# Altium project NewSpeedRadar_Board.PrjPcb
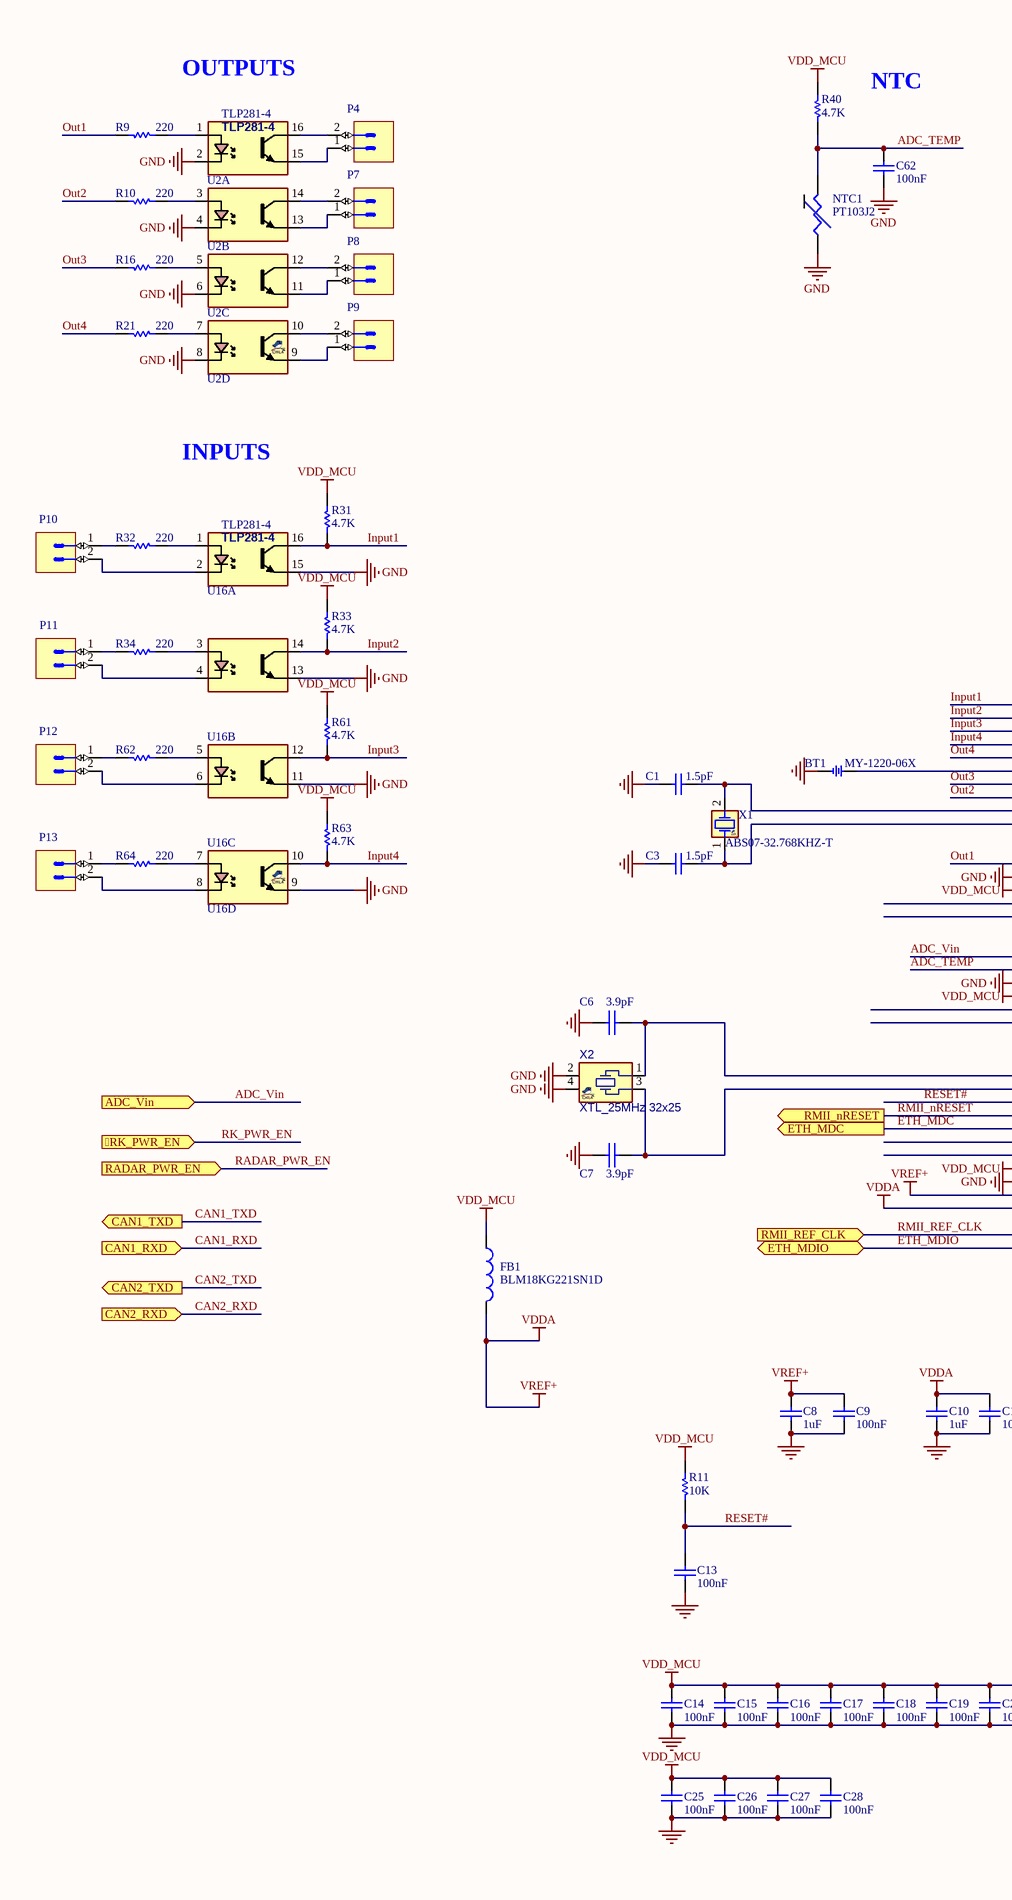
[diagram p0: STM32H743IIT6.SchDoc, left]
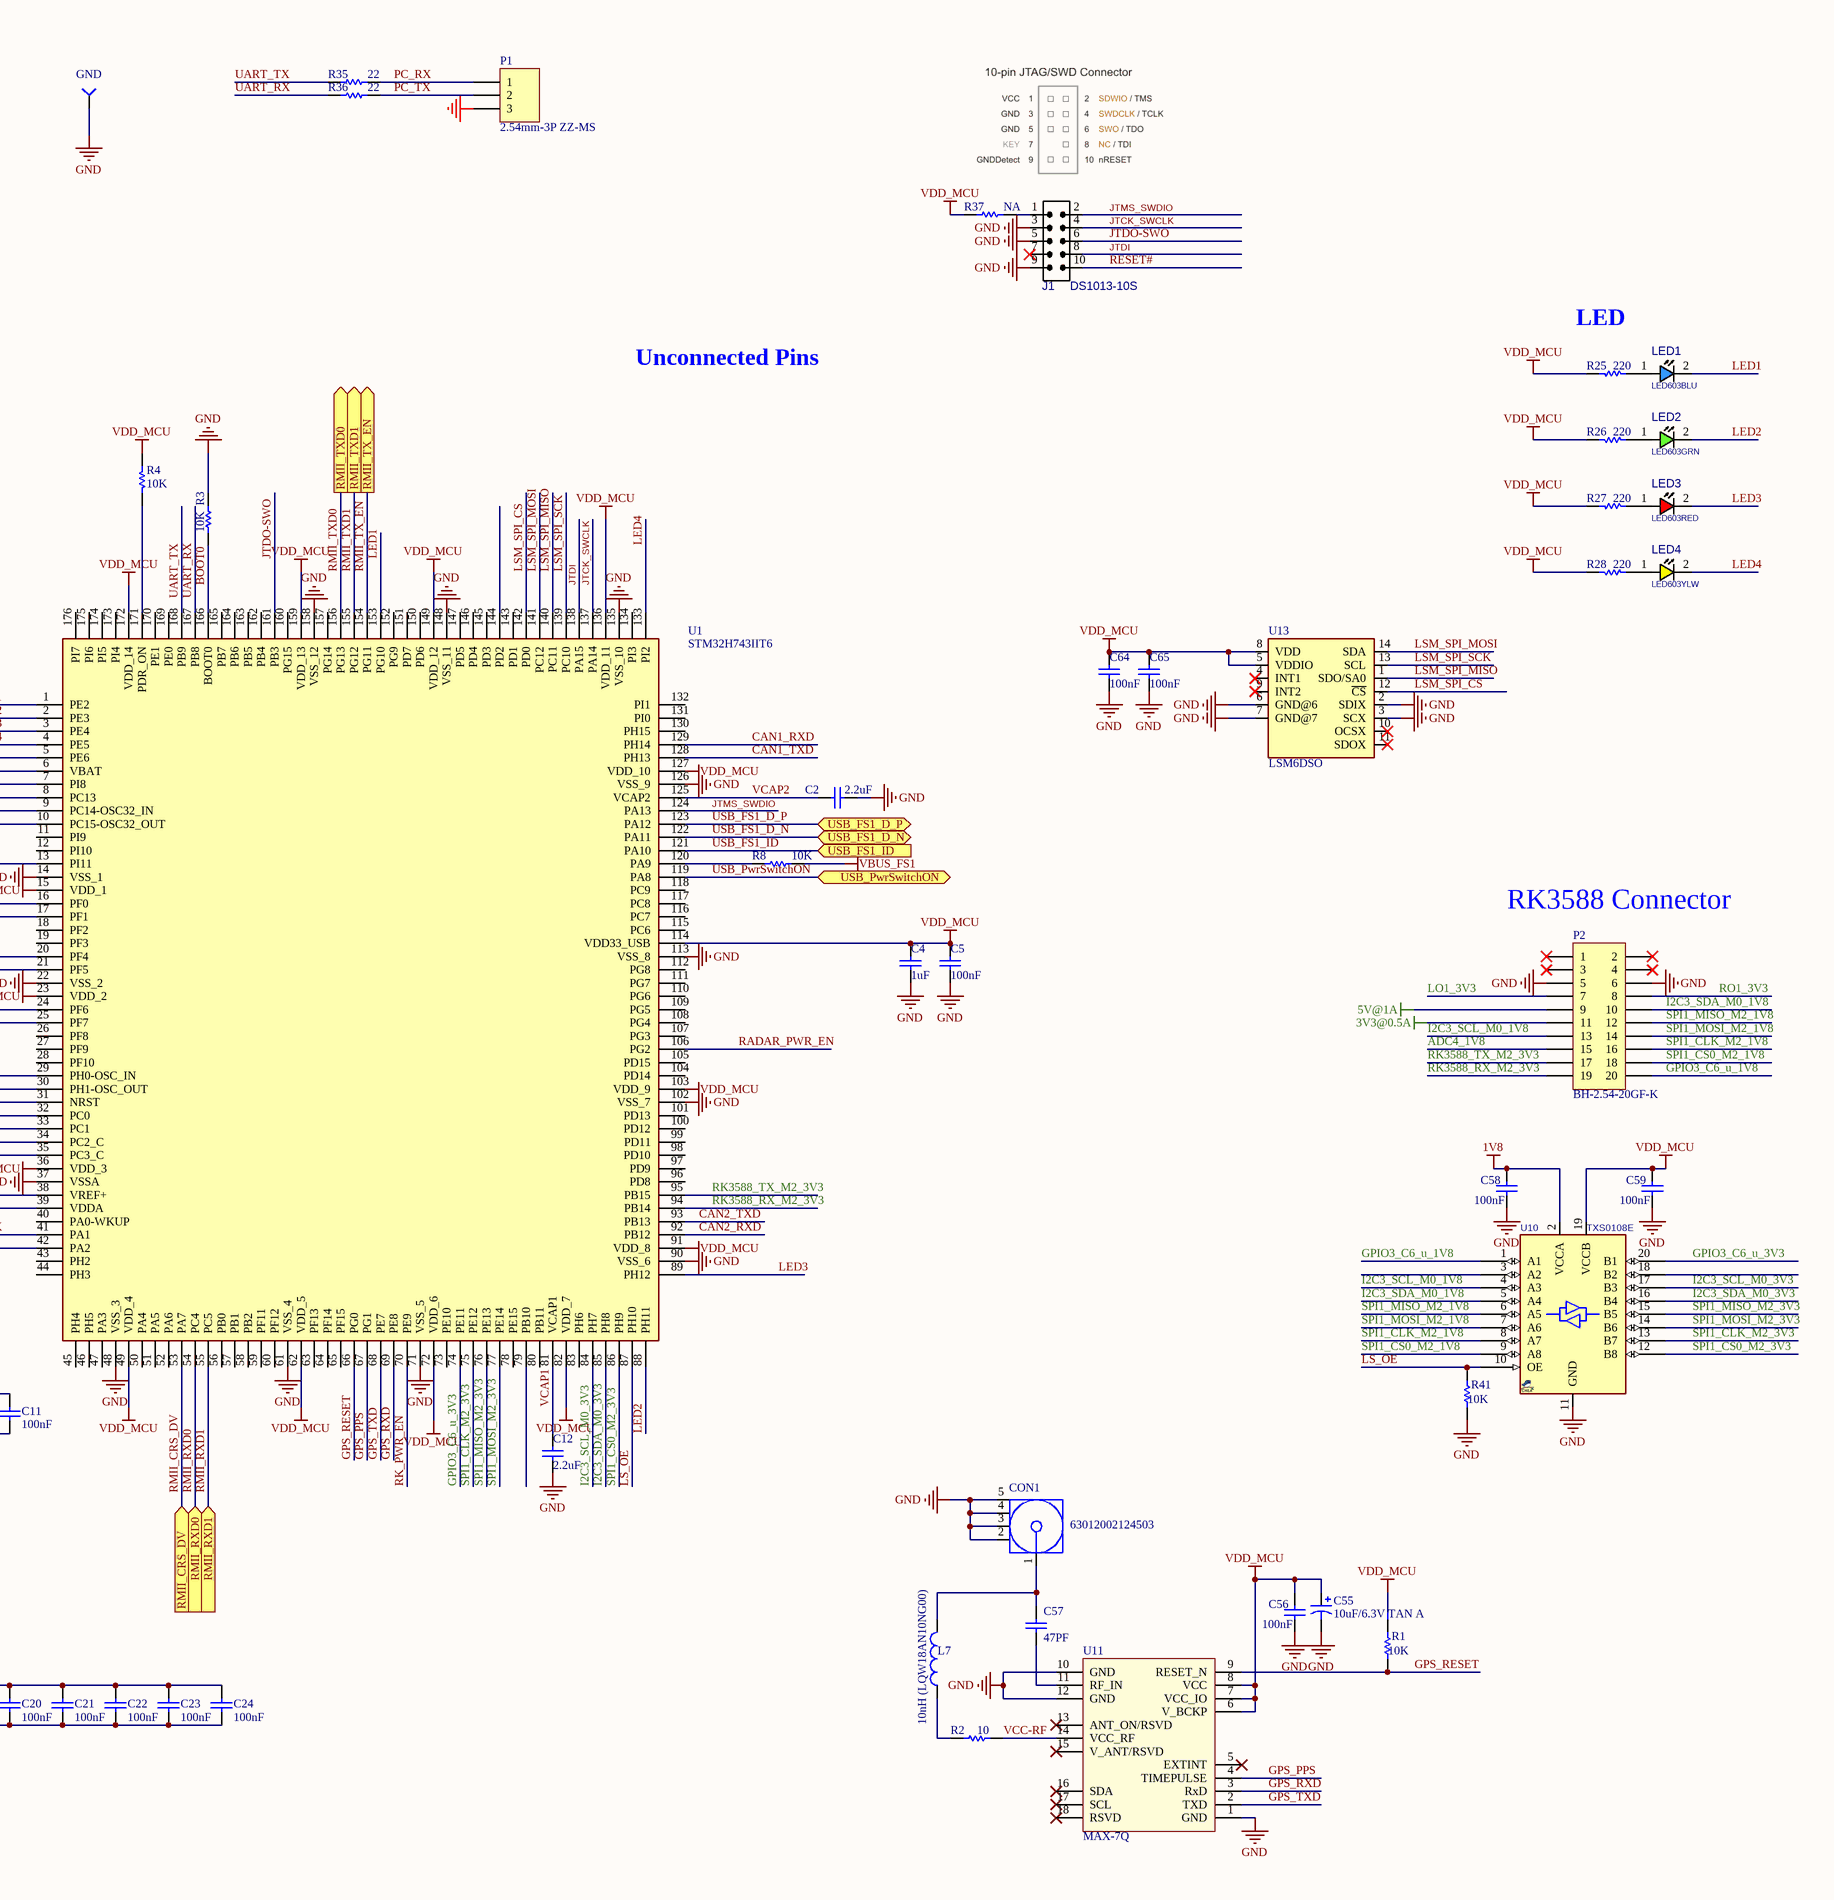
[diagram p1: STM32H743IIT6.SchDoc, right]
4 sheets, 208 parts. Net scope: flat (ports and power ports of the same name join across sheets).
Board file: NewSpeedRadar_Board.PcbDoc
Sheets:
  STM32H743IIT6.SchDoc
  Ethernet.SchDoc
  USB_OTG_FS.SchDoc
  Power_CAN_IO_GPS.SchDoc

## Sheet STM32H743IIT6.SchDoc
size A2

### Parts
BT1  MY-1220-06X  [BAT-TH_MY-1220-01]
C1  1.5pF  [C0603]
C2  2.2uF  [C0603]
C3  1.5pF  [C0603]
C4  1uF  [C0603]
C5  100nF  [C0603]
C6  3.9pF  [C0603]
C7  3.9pF  [C0603]
C8  1uF  [C0603]
C9  100nF  [C0603]
C10  1uF  [C0603]
C11  100nF  [C0603]
C12  2.2uF  [C0603]
C13  100nF  [C0603]
C14  100nF  [C0603]
C15  100nF  [C0603]
C16  100nF  [C0603]
C17  100nF  [C0603]
C18  100nF  [C0603]
C19  100nF  [C0603]
C20  100nF  [C0603]
C21  100nF  [C0603]
C22  100nF  [C0603]
C23  100nF  [C0603]
C24  100nF  [C0603]
C25  100nF  [C0603]
C26  100nF  [C0603]
C27  100nF  [C0603]
C28  100nF  [C0603]
C55  10uF/6.3V TAN A  [TANTALUM-A]
C56  100nF  [C0603]
C57  47PF  [C0603]
C58  100nF  [C0603]
C59  100nF  [C0603]
C62  100nF  [C0603]
C64  100nF  [C0603]
C65  100nF  [C0603]
CON1  63012002124503  [SMA]
FB1  BLM18KG221SN1D  [L0603E]
GND  TEST POINT  [TEST_POINT]  (value not drawn)  (no BOM)
J1  DS1013-10S  [IDC_2X5]
L7  10nH (LQW18AN10NG00)  [L0603E]
LED1  LED603BLU  [LED0603BLU]
LED2  LED603GRN  [LED0603GRN]
LED3  LED603RED  [LED0603RED]
LED4  LED603YLW  [LED0603YLW]
NTC1  PT103J2  [HDR1X2]
P1  2.54mm-3P ZZ-MS  [xh-3]
P2  BH-2.54-20GF-K  [HDR2X10]
P4  JST PH 2mm 2P RIGHT  [JST B2B-PH-K]  (value not drawn)
P7  JST PH 2mm 2P RIGHT  [JST B2B-PH-K]  (value not drawn)
P8  JST PH 2mm 2P RIGHT  [JST B2B-PH-K]  (value not drawn)
P9  JST PH 2mm 2P RIGHT  [JST B2B-PH-K]  (value not drawn)
P10  JST PH 2mm 2P RIGHT  [JST B2B-PH-K]  (value not drawn)
P11  JST PH 2mm 2P RIGHT  [JST B2B-PH-K]  (value not drawn)
P12  JST PH 2mm 2P RIGHT  [JST B2B-PH-K]  (value not drawn)
P13  JST PH 2mm 2P RIGHT  [JST B2B-PH-K]  (value not drawn)
R1  10K  [R0603]
R2  10  [R0603]
R3  10K  [R0603]
R4  10K  [R0603]
R8  10K  [R0603]
R9  220  [R0603]
R10  220  [R0603]
R11  10K  [R0603]
R16  220  [R0603]
R21  220  [R0603]
R25  220  [R0603]
R26  220  [R0603]
R27  220  [R0603]
R28  220  [R0603]
R31  4.7K  [R0603]
R32  220  [R0603]
R33  4.7K  [R0603]
R34  220  [R0603]
R35  22  [R0603]
R36  22  [R0603]
R37  NA  [R0603]  (no BOM)
R40  4.7K  [R0603]
R41  10K  [R0603]
R61  4.7K  [R0603]
R62  220  [R0603]
R63  4.7K  [R0603]
R64  220  [R0603]
U1  STM32H743IIT6  [QFP50P2600X2600X160-176N]
U2  TLP281-4  [SO_16]  (parts A,B,C,D of 4)
U10  TXS0108E  [SOG65_20]
U11  MAX-7Q  [MAX]
U13  LSM6DSO  [LGA-14_L3.0-W2.5-P0.50-TL]
U16  TLP281-4  [SO_16]  (parts A,B,C,D of 4)
X1  ABS07-32.768KHZ-T  [XTL_2_3215]
X2  XTL_25MHz 32x25  [XTL_4_3225]

### Ports
RK_PWR_EN (in), ADC_Vin (in), CAN1_RXD (in), CAN1_TXD (out), CAN2_RXD (in), CAN2_TXD (out), ETH_MDC (out), ETH_MDIO (bidir), RADAR_PWR_EN (in), RMII_CRS_DV (in), RMII_nRESET (out), RMII_REF_CLK (in), RMII_RXD0 (in), RMII_RXD1 (in), RMII_TX_EN (out), RMII_TXD0 (out), RMII_TXD1 (out), USB_FS1_D_N (bidir), USB_FS1_D_P (bidir), USB_FS1_ID (in), USB_PwrSwitchON (bidir)

### Nets
1V8: C58.1 U10.2(VCCA)
3V3@0.5A: P2.11
5V@1A: P2.9
GND: BT1.2 C1.2 C2.2 C3.2 C4.1 C5.1 C6.2 C7.2 C8.1 C9.1 C10.1 C11.1 C12.1 C13.1 C14.2 C15.2 C16.2 C17.2 C18.2 C19.2 C20.2 C21.2 C22.2 C23.2 C24.2 C25.2 C26.2 C27.2 C28.2 C55.2 C56.2 C58.2 C59.2 C62.1 C64.1 C65.1 CON1.2(GND) CON1.3(GND) CON1.4(GND) CON1.5(GND) GND.1(TP) J1.3 J1.5 J1.9 NTC1.1 P1.3 P2.5 P2.6 R3.2 R41.1 U1.14(VSS_1) U1.22(VSS_2) U1.37(VSSA) U1.48(VSS_3) U1.61(VSS_4) U1.71(VSS_5) U1.90(VSS_6) U1.102(VSS_7) U1.113(VSS_8) U1.126(VSS_9) U1.135(VSS_10) U1.148(VSS_11) U1.158(VSS_12) U2.2 U2.4 U2.6 U2.8 U10.11(GND) U11.1(GND) U11.10(GND) U11.12(GND) U13.2(SDIX) U13.3(SCX) U13.6(GND@6) U13.7(GND@7) U16.9 U16.11 U16.13 U16.15 X2.2 X2.4
VBUS_FS1: R8.1
VDD_MCU: C4.2 C5.2 C14.1 C15.1 C16.1 C17.1 C18.1 C19.1 C20.1 C21.1 C22.1 C23.1 C24.1 C25.1 C26.1 C27.1 C28.1 C55.1 C56.1 C59.1 C64.2 C65.2 FB1.1 R1.2 R4.1 R11.1 R25.1 R26.1 R27.1 R28.1 R31.2 R33.2 R37.2 R40.1 R61.2 R63.2 U1.15(VDD_1) U1.23(VDD_2) U1.36(VDD_3) U1.49(VDD_4) U1.62(VDD_5) U1.72(VDD_6) U1.82(VDD_7) U1.91(VDD_8) U1.103(VDD_9) U1.114(VDD33_USB) U1.127(VDD_10) U1.136(VDD_11) U1.149(VDD_12) U1.159(VDD_13) U1.172(VDD_14) U10.19(VCCB) U11.6(V_BCKP) U11.7(VCC_IO) U11.8(VCC) U13.5(VDDIO) U13.8(VDD)
VDDA: C8.2 C9.2 C10.2 C11.2 FB1.2 U1.38(VREF+) U1.39(VDDA)  [also labelled VREF+]
ADC4_1V8: P2.15
ADC_TEMP: C62.2 NTC1.2 R40.2 U1.21(PF5)
ADC_Vin: U1.20(PF4) ; port ADC_Vin
BOOT0: R3.1 U1.166(BOOT0)
CAN1_RXD: U1.129(PH14) ; port CAN1_RXD
CAN1_TXD: U1.128(PH13) ; port CAN1_TXD
CAN2_RXD: U1.92(PB12) ; port CAN2_RXD
CAN2_TXD: U1.93(PB13) ; port CAN2_TXD
ETH_MDC: U1.33(PC1) ; port ETH_MDC
ETH_MDIO: U1.42(PA2) ; port ETH_MDIO
GPIO3_C6_u_1V8: P2.20 U10.1(A1)
GPIO3_C6_u_3V3: U1.74(PE11) U10.20(B1)
GPS_PPS: U1.67(PG1) U11.4(TIMEPULSE)
GPS_RESET: R1.1 U1.66(PG0) U11.9(RESET_N)
GPS_RXD: U1.69(PE8) U11.3(RxD)
GPS_TXD: U1.68(PE7) U11.2(TXD)
I2C3_SCL_M0_1V8: P2.13 U10.4(A3)
I2C3_SCL_M0_3V3: U1.84(PH7) U10.17(B3)
I2C3_SDA_M0_1V8: P2.10 U10.5(A4)
I2C3_SDA_M0_3V3: U1.85(PH8) U10.16(B4)
Input1: R31.1 U1.1(PE2) U16.16
Input2: R33.1 U1.2(PE3) U16.14
Input3: R61.1 U1.3(PE4) U16.12
Input4: R63.1 U1.4(PE5) U16.10
JTCK_SWCLK: J1.4 U1.137(PA14)
JTDI: J1.8 U1.138(PA15)
JTDO-SWO: J1.6 U1.161(PB3)
JTMS_SWDIO: J1.2 U1.124(PA13)
LED1: LED1.2(CATHODE) U1.153(PG10)
LED2: LED2.2(CATHODE) U1.88(PH11)
LED3: LED3.2(CATHODE) U1.89(PH12)
LED4: LED4.2(CATHODE) U1.133(PI2)
LO1_3V3: P2.7
LS_OE: R41.2 U1.87(PH10) U10.10(OE)
LSM_SPI_CS: U1.142(PD0) U13.12(~{CS})
LSM_SPI_MISO: U1.140(PC11) U13.1(SDO/SA0)
LSM_SPI_MOSI: U1.141(PC12) U13.14(SDA)
LSM_SPI_SCK: U1.139(PC10) U13.13(SCL)
Out1: R9.1 U1.13(PI11)
Out2: R10.1 U1.8(PC13)
Out3: R16.1 U1.7(PI8)
Out4: R21.1 U1.5(PE6)
PC_RX: P1.1 R35.1
PC_TX: P1.2 R36.1
RADAR_PWR_EN: U1.106(PG2) ; port RADAR_PWR_EN
RESET#: C13.2 J1.10 R11.2 U1.31(NRST)
RK3588_RX_M2_3V3: P2.19 U1.94(PB14)
RK3588_TX_M2_3V3: P2.17 U1.95(PB15)
RK_PWR_EN: U1.70(PE9) ; port RK_PWR_EN
RMII_CRS_DV: U1.53(PA7) ; port RMII_CRS_DV
RMII_nRESET: U1.32(PC0) ; port RMII_nRESET
RMII_REF_CLK: U1.41(PA1) ; port RMII_REF_CLK
RMII_RXD0: U1.54(PC4) ; port RMII_RXD0
RMII_RXD1: U1.55(PC5) ; port RMII_RXD1
RMII_TX_EN: U1.154(PG11) ; port RMII_TX_EN
RMII_TXD0: U1.156(PG13) ; port RMII_TXD0
RMII_TXD1: U1.155(PG12) ; port RMII_TXD1
RO1_3V3: P2.8
SPI1_CLK_M2_1V8: P2.16 U10.8(A7)
SPI1_CLK_M2_3V3: U1.75(PE12) U10.13(B7)
SPI1_CS0_M2_1V8: P2.18 U10.9(A8)
SPI1_CS0_M2_3V3: U1.86(PH9) U10.12(B8)
SPI1_MISO_M2_1V8: P2.12 U10.6(A5)
SPI1_MISO_M2_3V3: U1.76(PE13) U10.15(B5)
SPI1_MOSI_M2_1V8: P2.14 U10.7(A6)
SPI1_MOSI_M2_3V3: U1.77(PE14) U10.14(B6)
UART_RX: R36.2 U1.167(PB8)
UART_TX: R35.2 U1.168(PB9)
USB_FS1_D_N: U1.122(PA11) ; port USB_FS1_D_N
USB_FS1_D_P: U1.123(PA12) ; port USB_FS1_D_P
USB_FS1_ID: U1.121(PA10) ; port USB_FS1_ID
USB_PwrSwitchON: U1.119(PA8) ; port USB_PwrSwitchON
VCAP1: C12.2 U1.81(VCAP1)
VCAP2: C2.1 U1.125(VCAP2)
VCC-RF: R2.1 U11.14(VCC_RF)
NetBT1_1: BT1.1 U1.6(VBAT)
NetC1_1: C1.1 U1.9(PC14-OSC32_IN) X1.2(OSC2)
NetC3_1: C3.1 U1.10(PC15-OSC32_OUT) X1.1(OSC1)
NetC6_1: C6.1 U1.29(PH0-OSC_IN) X2.1
NetC7_1: C7.1 U1.30(PH1-OSC_OUT) X2.3
NetC57_1: C57.1 CON1.1(Signal) L7.2
NetC57_2: C57.2 U11.11(RF_IN)
NetJ1_1: J1.1 R37.1
NetL7_1: L7.1 R2.2
NetLED1_1: LED1.1(ANODE) R25.2
NetLED2_1: LED2.1(ANODE) R26.2
NetLED3_1: LED3.1(ANODE) R27.2
NetLED4_1: LED4.1(ANODE) R28.2
NetP4_1: P4.1 U2.15
NetP4_2: P4.2 U2.16
NetP7_1: P7.1 U2.13
NetP7_2: P7.2 U2.14
NetP8_1: P8.1 U2.11
NetP8_2: P8.2 U2.12
NetP9_1: P9.1 U2.9
NetP9_2: P9.2 U2.10
NetP10_1: P10.1 R32.1
NetP10_2: P10.2 U16.2
NetP11_1: P11.1 R34.1
NetP11_2: P11.2 U16.4
NetP12_1: P12.1 R62.1
NetP12_2: P12.2 U16.6
NetP13_1: P13.1 R64.1
NetP13_2: P13.2 U16.8
NetR4_2: R4.2 U1.171(PDR_ON)
NetR8_2: R8.2 U1.120(PA9)
NetR9_2: R9.2 U2.1
NetR10_2: R10.2 U2.3
NetR16_2: R16.2 U2.5
NetR21_2: R21.2 U2.7
NetR32_2: R32.2 U16.1
NetR34_2: R34.2 U16.3
NetR62_2: R62.2 U16.5
NetR64_2: R64.2 U16.7

Not connected (* = marked no-connect by the designer): J1 7*; P2 1* 2* 3* 4*; U1 11(PI9) 12(PI10) 16(PF0) 17(PF1) 18(PF2) 19(PF3) 24(PF6) 25(PF7) 26(PF8) 27(PF9) 28(PF10) 34(PC2_C) 35(PC3_C) 40(PA0-WKUP) 43(PH2) 44(PH3) 45(PH4) 46(PH5) 47(PA3) 50(PA4) 51(PA5) 52(PA6) 56(PB0) 57(PB1) 58(PB2) 59(PF11) 60(PF12) 63(PF13) 64(PF14) 65(PF15) 73(PE10) 78(PE15) 79(PB10) 80(PB11) 83(PH6) 96(PD8) 97(PD9) 98(PD10) 99(PD11) 100(PD12) 101(PD13) 104(PD14) 105(PD15) 107(PG3) 108(PG4) 109(PG5) 110(PG6) 111(PG7) 112(PG8) 115(PC6) 116(PC7) 117(PC8) 118(PC9) 130(PH15) 131(PI0) 132(PI1) 134(PI3) 143(PD1) 144(PD2) 145(PD3) 146(PD4) 147(PD5) 150(PD6) 151(PD7) 152(PG9) 157(PG14) 160(PG15) 162(PB4) 163(PB5) 164(PB6) 165(PB7) 169(PE0) 170(PE1) 173(PI4) 174(PI5) 175(PI6) 176(PI7); U10 3(A2) 18(B2); U11 5(EXTINT)* 13(ANT_ON/RSVD)* 15(V_ANT/RSVD)* 16(SDA)* 17(SCL)* 18(RSVD)*; U13 4(INT1)* 9(INT2)* 10(OCSX)* 11(SDOX)*

### Notes on the sheet
- OUTPUTS
- NTC
- Unconnected Pins
- LED
- INPUTS
- (near P2) RK3588 Connector

### Library data of the parts
BT1 = BATH_CR1220: BATTERY HOLDER, CR1220; VALUE: BAT3volt; MANF_P#: -; .: http://www.chila.ir
C1 C3 = Capacitor_ST: Value: 100nF; Revision: July-2002: Re-released for DXP Platform.
C2 C4 C5 C8-C12 C64 C65 = Cap: Value: 10nF; Published: 8-Jun-2000; Revision: July-2002: Re-released for DXP Platform.; Publisher: Altium Limited
C6 C7 C14-C28 = CAP
  C14-C28: Published: 8-Jun-2000; Revision: July-2002: Re-released for DXP Platform.; Publisher: Altium Limited; Value: 100nF
C13 C62 = CAP: Value: 100pF; Published: 8-Jun-2000; Revision: July-2002: Re-released for DXP Platform.; Publisher: Altium Limited
C55 = CAP POL1: SMD Capacitor Tantalum 1UF 10V 10% 1206; Manufacturer: Vishay or Panasonic; Foot print: 1206 (3216 Metric); Published: 8-Jun-2000; LatestRevisionDate: 17-Jul-2002; LatestRevisionNote: Re-released for DXP Platform.; PackageReference: RB7.6-15; Publisher: Altium Limited; Value: 10uF/6.3V TAN A
C56 C58 C59 = Cap: Ceramic Capacitor; Manufacturer: Vishay or Panasonic; Foot print: 0805 (2012 Metric); Published: 8-Jun-2000; LatestRevisionDate: 17-Jul-2002; LatestRevisionNote: Re-released for DXP Platform.; PackageReference: RAD-0.3; Publisher: Altium Limited; Value: 100nF
C57 = Cap: Chip Monolithic Ceramic Capacitor; SMD; Manufacturer: Murata Electronics North America; Manufacturer Part Number: GRM188R71C104KA01D; Current Footprint: 0603 (1608 Metric); Board Qty: 100; PCB Name: Main_PCB; Packing List: CL10B104KB8NNNC; ITEM/NO: 40; ComponentLink1Description: Datasheet; HelpURL: D:\HNA\Datasheet Documents\c02e.pdf; ComponentLink1URL: D:\HNA\Datasheet Documents\c02e.pdf; Mounting Type: Surface Mount; Supplier: NULL; Part Number: 47PF; Supplier Part Number: NULL; Pricing: NULL; Package / Case: 0603 (1608 Metric); Size / Dimension: NULL; Description1: Chip Monolithic Ceramic Capacitor; SMD
CON1 = 19-46-2-TGG: SMA Connector, PCB THT Jack, Straight; Manufacturer: Amphenol Connex; PartNumber: 132134; Foot print: Through Hole; Published: 12-Dec-2006; DatasheetVersion: rev.A-0, Jul-2002; PackageVersion: rev.A-0, Jul-2002; PackageReference: 19-46-2; Publisher: Altium Limited; PackageDescription: SMA Straight PCB Surface Mount Jack Receptacle; ComponentLink1Description: Manufacturer Link; ComponentLink1URL: http://www.chinnan.com.tw/
FB1 = Inductor: Ferrite Bead; Value: 100uH; Published: 8-Jun-2000; Revision: July-2002: Re-released for DXP Platform.; Publisher: Altium Limited
GND = TEST POINT: Board Qty: 100; PCB Name: Main_PCB
J1 = IDC_2X5: BOX HEADER 2*5 STRAIGHT; VALUE: IDC_2X5
L7 = Inductor: FIXED IND 10NH 300MA 0.10 OHM; Manufacturer: Murata Electronics North America; Manufacturer Part Number: 10nH/1%; Current Footprint: 0603 (1608 Metric); Board Qty: 100; PCB Name: Main_PCB; ITEM/NO: 16; Package / Case: 0603 (1608 Metric); Part Number: 10nH (LQW18AN10NG00); Pricing: 1=0.18, 10=0.167, 25=0.1504, 50=0.1302, 100=0.1169, 250=0.10856, 500=0.1002, 750=0.09519, 1000=0.08684 (USD); Size / Dimension: null; Supplier: null; Supplier Part Number: null
LED1 = LED_SMD_0603_BLU: LED, SMD, 0603, BLUE; PARAM: 30mA, 470nm, 120° Angle; DESC: DESCRIPTION; MANF_P#: MANF_PART#; PARAM2: 2.2~3V; MANF: MANF; ASSEMBLY: ASSEMBLY; PRICE: PRICE; VALUE: LED603BLU
LED2 = LED_SMD_0603_GRN: LED, SMD, 0603, GREEN; PARAM: 20mA; MANF: Kingbright; DESC: DESCRIPTION; MANF_P#: APT1608SGC; PARAM2: 2.2V; ASSEMBLY: ASSEMBLY; PRICE: 1: 0.14$, 100: 6.8$; VALUE: LED603GRN
LED3 = LED_SMD_0603_RED: LED, SMD, 0603, RED; PARAM: 30mA, 640nm; DESC: DESCRIPTION; MANF_P#: MANF_PART#; PARAM2: 1.8~2.5V; MANF: MANF; ASSEMBLY: ASSEMBLY; PRICE: PRICE; VALUE: LED603RED
LED4 = LED_SMD_0603_YLW: LED, SMD, 0603, YELLOW; DESC: DESCRIPTION; MANF_P#: MANF_PART#; PARAM2: 2.2V; MANF: MANF; ASSEMBLY: ASSEMBLY; PRICE: PRICE; VALUE: LED603YLW
NTC1 = NTC power: THERMISTOR 10K OHM +/-0.20 C; Device Code: 143161
P1 = Header 3: 1x3P XH 2.54mm Male Straight Wire To Board Connector; LatestRevisionDate: 17-Jul-2002; LatestRevisionNote: Re-released for DXP Platform.; Publisher: Altium Limited
P2 = Header 10X2: BOX HEADER 2*10 STRAIGHT; LatestRevisionDate: 17-Jul-2002; LatestRevisionNote: Re-released for DXP Platform.; Publisher: Altium Limited
P4 P7-P13 = PHOENIX_1803426: JST PH 2P RIGHT; Part Description: 8A 160 V, Pitch: 3.81mm, 2 Positions Header; Manufacturer: PHOENIX CONTACT; Manufacturer Part Number: 1803426 (MCV 1,5/2-G-3,81); PressFit: No; Part Number: PHOENIX_1803426; Component Kind: Standard; Component Type: Standard; Footprint: PHOENIX_1803426; Pin Count: 2; Mounted: Yes; Socket: No; SMD: No; Sense: No; Status: None; ComponentHeight: 9.2mm; HelpURL: \\cern.ch\dfs\Applications\Altium\Datasheets\PHOENIX_1803426.pdf; Author: CERN DEM JLC; CreateDate: 5/4/2010; LatestRevisionDate: 5/4/2010
R1 R41 = Res1: Resistor: thick film; SMD; Manufacturer: Yageo; Manufacturer Part Number: null; Current Footprint: 0603 (1608 Metric); Board Qty: 100; PCB Name: Main_PCB; Packing List: 0603F1002T5E; ITEM/NO: 20; ComponentLink1Description: Datasheet; HelpURL: D:\HNA\Datasheet Documents\PYu-RC_Group_51_RoHS_L_0.pdf; ComponentLink1URL: D:\HNA\Datasheet Documents\PYu-RC_Group_51_RoHS_L_0.pdf; Mounting Type: Surface Mount; Supplier: NULL; Part Number: 10K; Supplier Part Number: NULL; Pricing: NULL; Description1: Resistor: thick film; SMD; Package / Case: 0603 (1608 Metric); Size / Dimension: NULL
R2 = Res1: Resistor: thick film; SMD; Manufacturer: Yageo; Part Number: 10R; Manufacturer Part Number: null; Current Footprint: 0603 (1608 Metric); Board Qty: 100; PCB Name: Main_PCB; Packing List: 0603F1002T5E; ITEM/NO: 131; ComponentLink1Description: Datasheet; HelpURL: D:\HNA\Datasheet Documents\PYu-RC_Group_51_RoHS_L_0.pdf; ComponentLink1URL: D:\HNA\Datasheet Documents\PYu-RC_Group_51_RoHS_L_0.pdf; Mounting Type: Surface Mount; Supplier: null; Supplier Part Number: null; Pricing: 1=0.1, 10=0.029, 50=0.0162, 100=0.0123, 250=0.00912, 500=0.00672, 1000=0.00448, 2500=0.00378 (USD); Description1: Resistor: thick film; SMD; Package / Case: 0603 (1608 Metric); Size / Dimension: null
R3 R35 R36 = res1: Value: 1K; Published: 8-Jun-2000; Revision: July-2002: Re-released for DXP Platform.; Publisher: Altium Limited
R4 R8-R11 R16 R21 R25-R28 R31-R34 R37 R40 R61-R64 = Res1: Value: 1K; Published: 8-Jun-2000; Revision: July-2002: Re-released for DXP Platform.; Publisher: Altium Limited
U1 = STM32H743IIT6: Integrated Circuit; Manufacturer_Name: STMicroelectronics; Datasheet Link: https://componentsearchengine.com/Datasheets/1/STM32H743IIT6.pdf; Height: 1.6mm; Manufacturer_Part_Number: STM32H743IIT6; Mouser Part Number: 511-STM32H743IIT6; Mouser Price/Stock: https://www.mouser.co.uk/ProductDetail/STMicroelectronics/STM32H743IIT6?qs=FNcb6ahWXRzE163cq8Rfjg%3D%3D; Arrow Part Number: STM32H743IIT6; Arrow Price/Stock: https://www.arrow.com/en/products/stm32h743iit6/stmicroelectronics?region=nac
U2 U16 = OPTC_TR16P_TLP281-4_SMD: OPTOCOUPLER, TRANSISTOR, QUAD; MANF_P#: TLP281-4A; PRICE: 4000t@PAYA; VALUE: TLP281-4; PACKAGE: DIP-16SMD
U10 = TXS0108_SSOP20: Level Translator, Octal; MANF: Texas Instruments; MANF_P#: TXS0108EPWR; VALUE: TXS0108E
U11 = MAX: GPS chip module MAX-7Q; Manufacturer-1: ShenZhen Tifull Technology Ltd.; Manufacturer Part Number-1: TF1097U7M3; Part Number: EPP0910; Manufacturer: NULL; Current Footprint: SMD; Board Qty: 100; PCB Name: Main_PCB; ITEM/NO: 117; Package / Case: SMD; Part Number-1: MAX-7Q; Pricing: 1=12.00000, 100=12.00000 (USD); Size / Dimension: NULL; Supplier: Octopart; Supplier Part Number: Seeed Studio - 317050009; HelpURL: D:\HNA\Datasheet Documents\u-blox-MAX-7_DataSheet_(GPS.G7-HW-12012)_2.pdf; Part Number-2: TF1097U7M3; Manufacturer Part Number: NULL
U13 = LSM6DSO: SPARKFUN 6 DEGREES OF FREEDOM BR; MF: STMicroelectronics; SnapEDA_Link: https://www.snapeda.com/parts/LSM6DSO/STMicroelectronics/view-part/?ref=snap; Purchase-URL: https://pricing.snapeda.com/search/part/LSM6DSO/?ref=eda; Price: None; Availability: In Stock; Package: None; Check_prices: https://www.snapeda.com/parts/LSM6DSO/STMicroelectronics/view-part/?ref=eda; Value: *; MP: LSM6DSO
X1 = XTL_2_32.768_3215A: Crystal, 32.768KHz, 3pF, 20PPM; MANF: ABRACON; MANF_P#: ABS07W-32.768kHz-D-2-T; PARAM: -40~85oC; VALUE: XTL_32.768KHz; PARAM2: 3pF, 20PPM; PRICE: 1$
X2 = XTL_4_25MHz_3225: CRYSTAL 25.00 MHZ 18pF, 10PPM; MANF: EPSON; DESC: DESCRIPTION; DIST#: MOUSER; PARAM2: PARAM; MANF_P#: TSX-3225 25.0000MF10P-C3; ASSEMBLY: ASSEMBLY; PARAM: 10PPM; PRICE: 0.5$; VALUE: XTL_25MHz 32x25

## Sheet Ethernet.SchDoc: Ethernet
size A3; DocumentNumber: MB1246; Revision: B.1; SheetNumber: 7; SheetTotal: 17; Project: STM32H7xxI-EVAL
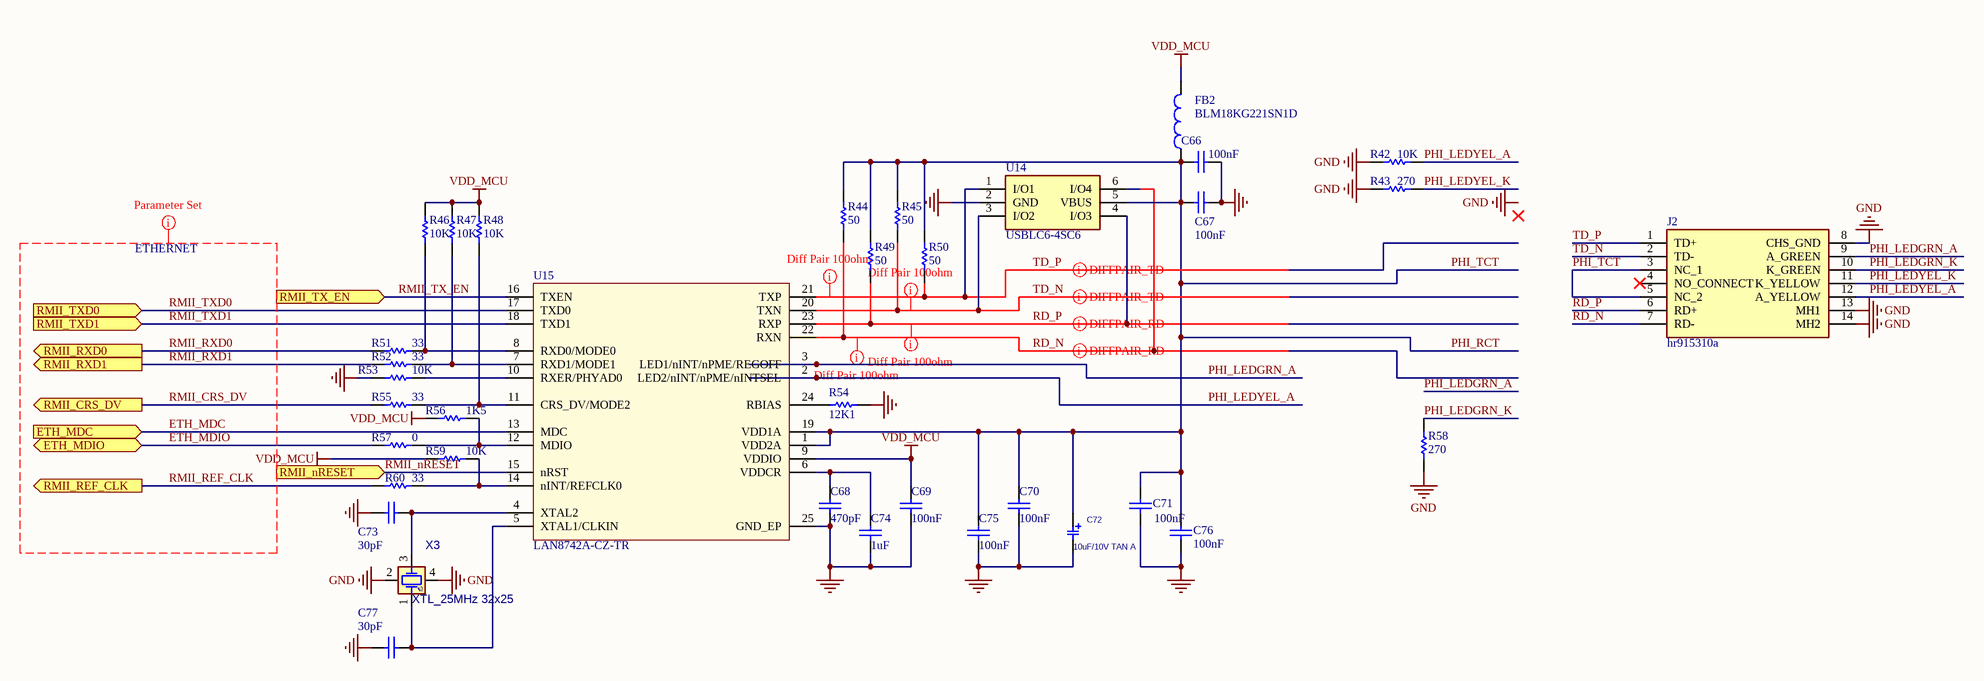
[diagram p2: Ethernet.SchDoc]

### Parts
C66  100nF  [C0603]
C67  100nF  [C0603]
C68  470pF  [C0603]
C69  100nF  [C0603]
C70  100nF  [C0603]
C71  100nF  [C0603]
C72  10uF/10V TAN A  [C_TN_3216]
C73  30pF  [C0603]
C74  1uF  [C0603]
C75  100nF  [C0603]
C76  100nF  [C0603]
C77  30pF  [C0603]
FB2  BLM18KG221SN1D  [L0603E]
J2  hr915310a  [hr915310a]
R42  10K  [R0603]
R43  270  [R0603]
R44  50  [R0603]
R45  50  [R0603]
R46  10K  [R0603]
R47  10K  [R0603]
R48  10K  [R0603]
R49  50  [R0603]
R50  50  [R0603]
R51  33  [R0603]
R52  33  [R0603]
R53  10K  [R0603]
R54  12K1  [R0603]
R55  33  [R0603]
R56  1K5  [R0603]
R57  0  [R0603]
R58  270  [R0603]
R59  10K  [R0603]
R60  33  [R0603]
U14  USBLC6-4SC6  [SOT95P280X145-6N]
U15  LAN8742A-CZ-TR  [QFN50P400X400X100-25N-D]
X3  XTL_25MHz 32x25  [XTL_4_3225]

### Ports
ETH_MDC (in), ETH_MDIO (bidir), RMII_CRS_DV (out), RMII_nRESET (in), RMII_REF_CLK (out), RMII_RXD0 (out), RMII_RXD1 (out), RMII_TX_EN (in), RMII_TXD0 (in), RMII_TXD1 (in)

### Nets
GND: C66.1 C67.1 C68.1 C69.1 C70.1 C71.1 C72.2 C73.2 C74.2 C75.1 C76.1 C77.2 J2.8(CHS_GND) J2.13(MH1) J2.14(MH2) R42.1 R43.1 R53.2 R54.2 R58.2 U14.2(GND) U15.25(GND_EP) X3.2(GND1) X3.4(GND2)
VDD_MCU: C69.2 FB2.2 R46.1 R47.1 R48.1 R56.2 R59.1 U15.9(VDDIO)
ETH_MDC: U15.13(MDC) ; port ETH_MDC
ETH_MDIO: R57.2 ; port ETH_MDIO
PHI_LEDGRN_A: J2.9(A_GREEN) U15.3(LED1/nINT/nPME/REGOFF)
PHI_LEDGRN_K: J2.10(K_GREEN) R58.1
PHI_LEDYEL_A: J2.12(A_YELLOW) R42.2 U15.2(LED2/nINT/nPME/nINTSEL)
PHI_LEDYEL_K: J2.11(K_YELLOW) R43.2
PHI_RCT: C66.2 C67.2 C70.2 C71.2 C72.1 C75.2 C76.2 FB2.1 J2.3(NC_1) J2.5(NC_2) R44.2 R45.2 R49.2 R50.2 U14.5(VBUS) U15.1(VDD2A) U15.19(VDD1A)  [also labelled PHI_TCT]
RD_N: J2.7(RD-) R44.1 U14.6(I/O4) U15.22(RXN)
RD_P: J2.6(RD+) R49.1 U14.4(I/O3) U15.23(RXP)
RMII_CRS_DV: R55.2 ; port RMII_CRS_DV
RMII_nRESET: U15.15(nRST) ; port RMII_nRESET
RMII_REF_CLK: R60.2 ; port RMII_REF_CLK
RMII_RXD0: R51.2 ; port RMII_RXD0
RMII_RXD1: R52.2 ; port RMII_RXD1
RMII_TX_EN: U15.16(TXEN) ; port RMII_TX_EN
RMII_TXD0: U15.17(TXD0) ; port RMII_TXD0
RMII_TXD1: U15.18(TXD1) ; port RMII_TXD1
TD_N: J2.2(TD-) R45.1 U14.3(I/O2) U15.20(TXN)
TD_P: J2.1(TD+) R50.1 U14.1(I/O1) U15.21(TXP)
NetC68_2: C68.2 C74.1 U15.6(VDDCR)
NetC73_1: C73.1 U15.4(XTAL2) X3.3(XB)
NetC77_1: C77.1 U15.5(XTAL1/CLKIN) X3.1(XA)
NetR46_2: R46.2 R51.1 U15.8(RXD0/MODE0)
NetR47_2: R47.2 R52.1 U15.7(RXD1/MODE1)
NetR48_2: R48.2 R55.1 U15.11(CRS_DV/MODE2)
NetR53_1: R53.1 U15.10(RXER/PHYAD0)
NetR54_1: R54.1 U15.24(RBIAS)
NetR56_1: R56.1 R57.1 U15.12(MDIO)
NetR59_2: R59.2 R60.1 U15.14(nINT/REFCLK0)

Not connected (* = marked no-connect by the designer): J2 4(NO_CONNECT)*

### Layout directives
differential pair: RD_N, RD_P, TD_N, TD_P
rule Matched Net Lengths [Tolerance = 100mil]: RD_N, RD_P, TD_N, TD_P
net class ETHERNET: ETH_MDC, ETH_MDIO, RMII_CRS_DV, RMII_REF_CLK, RMII_RXD0, RMII_RXD1, RMII_TXD0, RMII_TXD1

### Notes on the sheet
- Labels drawn without touching a wire or pin: GND
- Title:
- Project:
- Size:
- Date:
- A4
- Reference:
- Sheet:
- Revision:
- of

### Library data of the parts
C66 C67 C69-C71 C75 C76 = Capacitor_ST: Revision: July-2002: Re-released for DXP Platform.; Value: 100nF
C68 C73 C77 = Capacitor_ST: Value: 100nF; Revision: July-2002: Re-released for DXP Platform.
C72 = CAP_SMD_TAN_10uF_6.3V: CAP, SMD, TAN; PARAM: 20%, 300mOhm, -55~105oC; MANF: VISHAY; MANF_P#: T55A106M6R3C0300; PARAM2: 6.3V; VALUE: 10uF; PRICE: 0.46$
C74 = CAP SMD 0603  X5R 1µF 25V 10%: 0603  X5R 1µF; Rated voltage: 25V; Tolerance: 10%; Manufacturer: *; Manufacturer P/N: *; Order code Farnell: 1288202RL; Value: 1µF; Power: *; Technology: X5R; Temperature  Factor: *; Temperature Max: +125°C; Temperature Min: -55°C; STS Code: *
FB2 = Inductor: Ferrite Bead; Value: 100uH; Published: 8-Jun-2000; Revision: July-2002: Re-released for DXP Platform.; Publisher: Altium Limited
J2 = hr915310a: Manufacturer_Name: Hanrun Electronics; Datasheet Link: https://www.lcsc.com/datasheet/lcsc_datasheet_2411121057_HANRUN-Zhongshan-HanRun-Elec-HR915310A_C2760326.pdf; Height: 17.15mm; Manufacturer_Part_Number: hr915310a
R42 R46-R48 R53 R59 = Resistor_ST: Value: 10K
R43 R58 = Resistor_ST: Value: 10K
R44 R45 R49 R50 = Res_50_1%_0603: Manuf_Part_1: RC0402FR-0750RL; Manuf_1: YAGEO; Value: 50; Order: *; ECCN_US/EU: n/a; Distrib: FARNELL
R51 R52 R55 R60 = Res_33_1%_0402: Manuf_Part_1: RC0402FR-0733RL; Manuf_1: YAGEO; Value: 33; Order: *; ECCN_US/EU: n/a; Distrib: FARNELL
R54 = Res_12K1_1%_0603: Manuf_Part_1: MCT 0603-50 1% P5 12K1; Manuf_1: VISHAY; Order: 2325243; Value: 12K1; ECCN_US/EU: n/a; Distrib: FARNELL
R56 = Res_1K5_1%_0402: Manuf_Part_1: RC0402FR-071K5L; Manuf_1: YAGEO; Value: 1K5; Order: RC0402FR-071K5L; ECCN_US/EU: n/a; Distrib: FARNELL
R57 = Res1: Value: 1K; Published: 8-Jun-2000; Revision: July-2002: Re-released for DXP Platform.; Publisher: Altium Limited
U14 = USBLC6-4SC6: Integrated Circuit; Manufacturer_Name: STMicroelectronics; Datasheet Link: http://www.st.com/st-web-ui/static/active/en/resource/technical/document/datasheet/CD00047494.pdf; Height: 1.45mm; Manufacturer_Part_Number: USBLC6-4SC6; Mouser Part Number: 511-USBLC6-4SC6; Mouser Price/Stock: https://www.mouser.co.uk/ProductDetail/STMicroelectronics/USBLC6-4SC6?qs=k9dH%2Fx4GHJCNdehb8zInZg%3D%3D; Arrow Part Number: USBLC6-4SC6; Arrow Price/Stock: https://www.arrow.com/en/products/usblc6-4sc6/stmicroelectronics?region=europe
U15 = LAN8742A-CZ-TR: LAN8742A-CZ-TR - Small Footprint RMII 10/100 Ethernet, Transceiver with HP Auto-MDIX and flexPWR Technology SQFN-24; Manuf_1: MICROCHIP; Order: LAN8742A-CZ-TR; Manuf_Part_1: LAN8742A-CZ-TR; Distrib: MICROCHIP
X3 = XTL_4_25MHz_3225: as X2 on sheet STM32H743IIT6; ASSEMBLY: ASSEMBLY; PARAM: 10PPM; PRICE: 0.5$; VALUE: 25MHz 32x25

## Sheet USB_OTG_FS.SchDoc: USB_OTG_FS
size A4; DocumentNumber: MB1246; Revision: B.1; SheetNumber: 9; SheetTotal: 17; Project: STM32H7xxI-EVAL
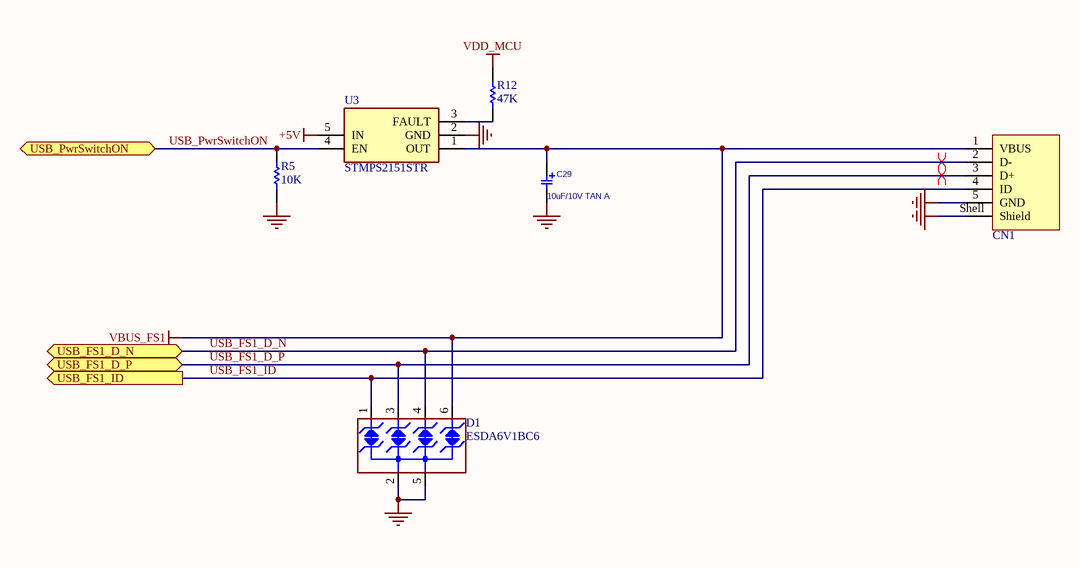
[diagram p3: USB_OTG_FS.SchDoc]

### Parts
C29  10uF/10V TAN A  [C_TN_3216]
CN1  651005136421  [651005136421]  (value not drawn)
D1  ESDA6V1BC6  [SOT95P280X145-6N]
R5  10K  [R0603]
R12  47K  [R0603]
U3  STMPS2151STR  [SOT95P280X145-5N]

### Ports
USB_FS1_D_N (bidir), USB_FS1_D_P (bidir), USB_FS1_ID (out), USB_PwrSwitchON (bidir)

### Nets
+5V: U3.5(IN)
GND: C29.2 CN1.5(GND) CN1.Shell(Shield) D1.2(IO2) D1.5(IO4) R5.2 U3.2(GND)
VBUS_FS1: C29.1 CN1.1(VBUS) D1.6(NC) U3.1(OUT)
VDD_MCU: R12.1
USB_FS1_D_N: CN1.2(D-) D1.4(IO3) ; port USB_FS1_D_N
USB_FS1_D_P: CN1.3(D+) D1.3(GND) ; port USB_FS1_D_P
USB_FS1_ID: CN1.4(ID) D1.1(IO1) ; port USB_FS1_ID
USB_PwrSwitchON: R5.1 U3.4(EN) ; port USB_PwrSwitchON
NetR12_2: R12.2 U3.3(FAULT)

### Layout directives
differential pair: USB_FS1_D_N, USB_FS1_D_P

### Notes on the sheet
- Title:
- Project:
- Size:
- Date:
- A4
- Reference:
- Sheet:
- Revision:
- of

### Library data of the parts
C29 = CAP_SMD_TAN_10uF_6.3V: as C72 on sheet Ethernet; PRICE: 0.46$
CN1 = 651005136421: WR-COM Mini USB 2.0 Type B Vertical 5 Contacts; Manufacturer: Wurth Elektronik; Match Code: WR-USB; Gender: Receptacle; Interface Type: Type B; Number of Ports: 1; Rated Current: 1A; Working Voltage: 30V (AC); Manufacturer Part Number: 651005136421; Category: Input/Output Connectors; ComponentLink1Description: Website Link; ComponentLink1URL: https://www.we-online.com/redexpert/article/651005136421?ad; ComponentLink2Description: Datasheet Link; ComponentLink2URL: https://www.we-online.com/redexpert/spec/651005136421?ad; Mount: Through Hole; Operating Temperature Max: 105°C; Operating Temperature Min: -40°C; Packaging: Tray; Application: Mini USB 2.0; Number of Pins: 5; Orientation: Vertical
D1 = ESDA6V1BC6: 4-line ESD protection; Manuf_1: STM; Manuf_Part_1: ESDA5V3L; Ref St: 9179034; Provided: ST; ECCN_US/EU: EAR99/NEC; Distrib: ST; Order: ESDA5V3L; Ordered by: STM
R5 R12 = res1: Value: 1K; Published: 8-Jun-2000; Revision: July-2002: Re-released for DXP Platform.; Publisher: Altium Limited
U3 = STMPS2151STR: Integrated Circuit; Manufacturer_Name: ST; Datasheet Link: https://www.st.com/resource/en/datasheet/stmps2141.pdf; Height: 1.45mm; Manufacturer_Part_Number: STMPS2151STR

## Sheet Power_CAN_IO_GPS.SchDoc
size A2
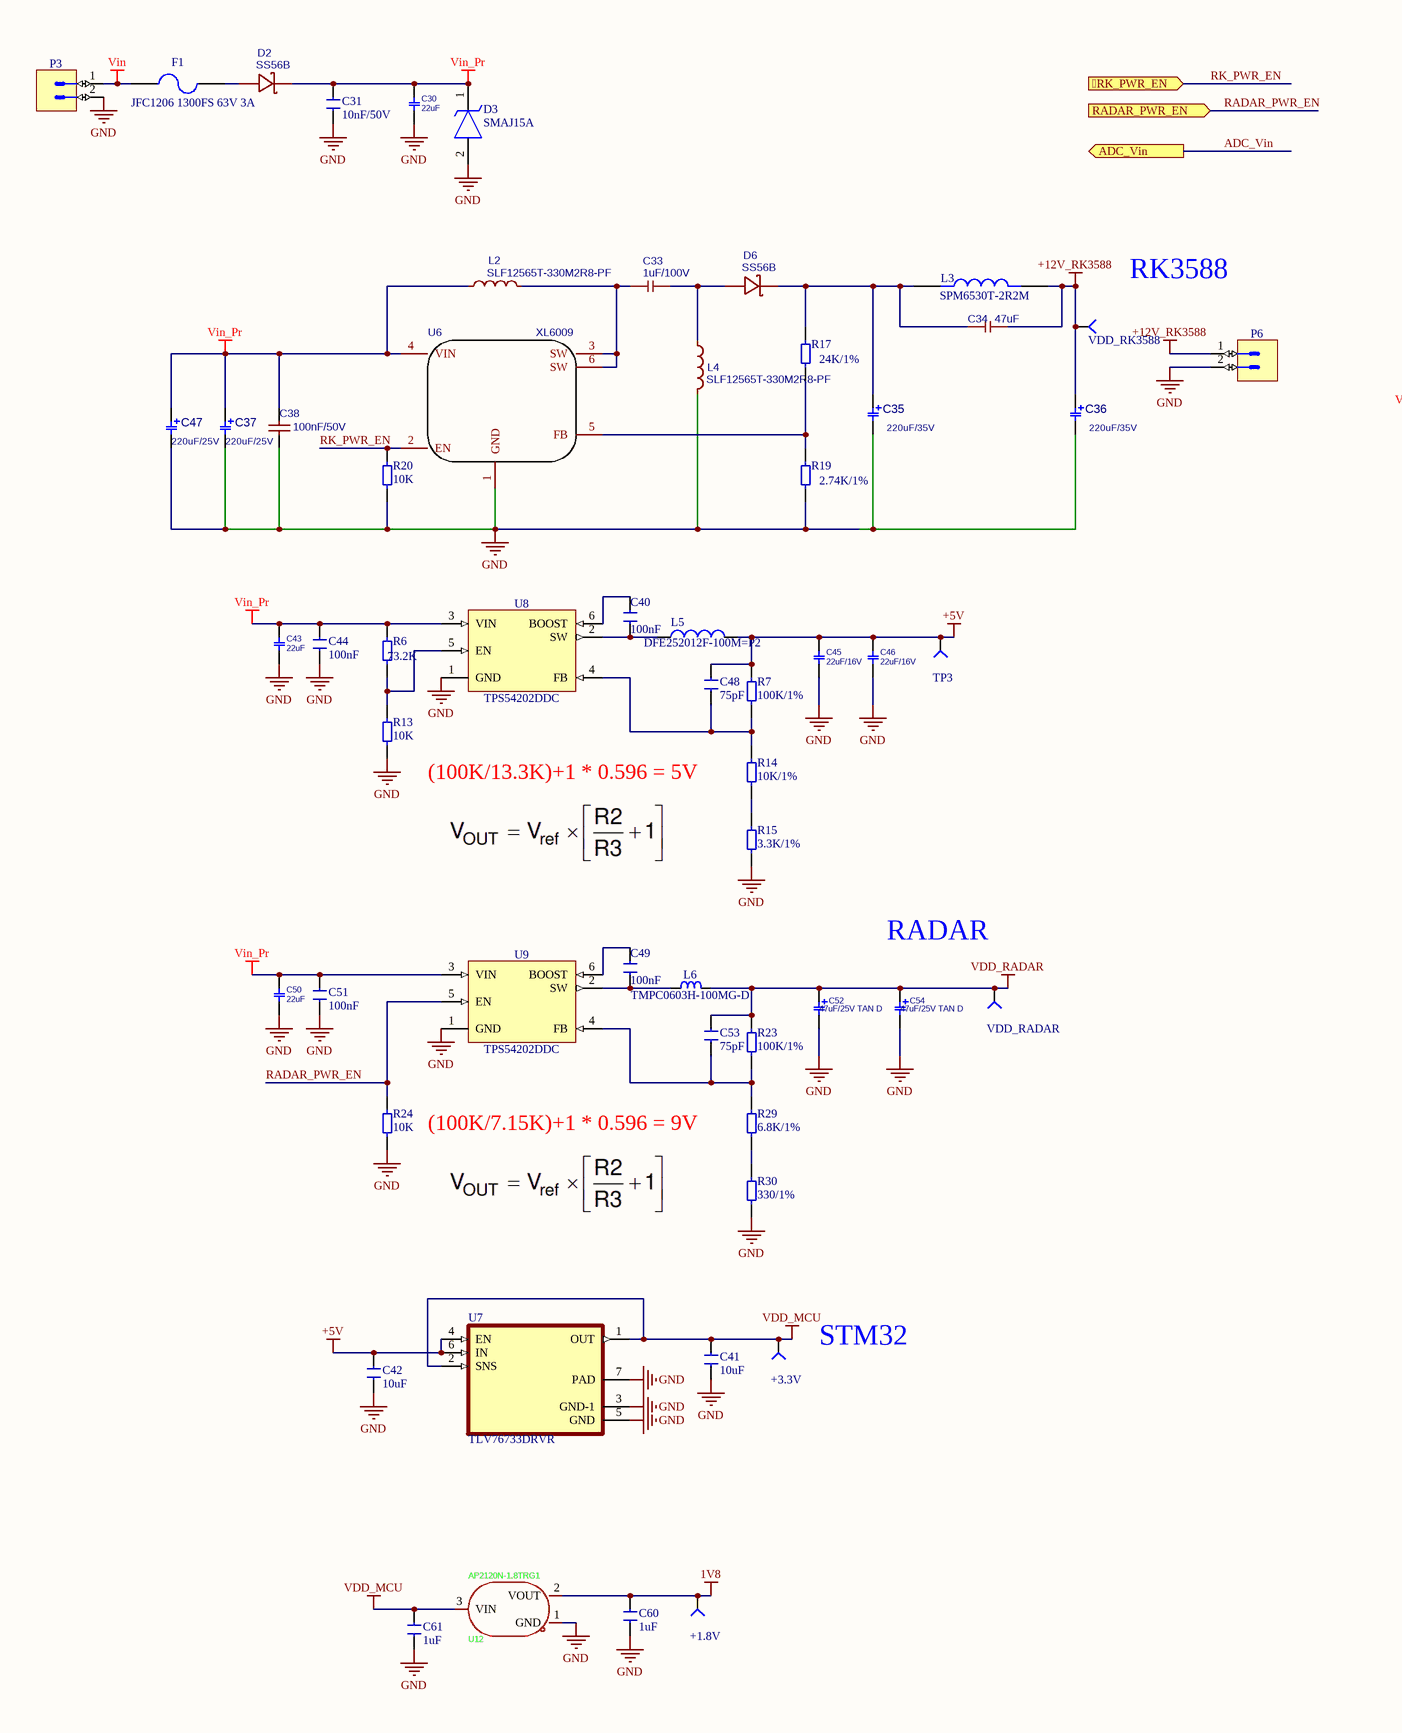
[diagram p4: Power_CAN_IO_GPS.SchDoc, left]
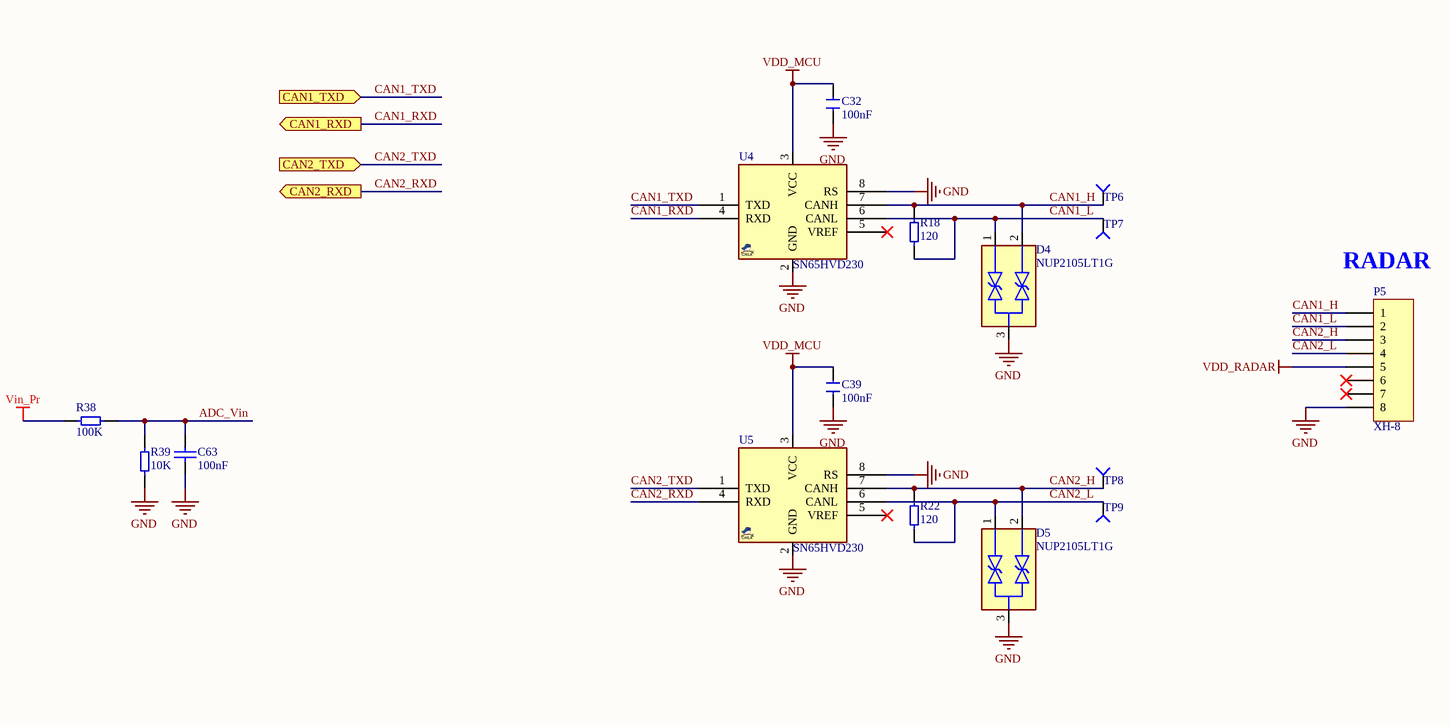
[diagram p5: Power_CAN_IO_GPS.SchDoc, right]

### Parts
+1.8V  TEST POINT  [TEST_POINT]  (value not drawn)  (no BOM)
+3.3V  TEST POINT  [TEST_POINT]  (value not drawn)  (no BOM)
C30  22uF  [C1206E]
C31  10nF/50V  [C0603E]
C32  100nF  [C0603E]
C33  1uF/100V  [C1210]
C34  47uF  [C1210]
C35  220uF/35V  [C_EL_D8L10]
C36  220uF/35V  [C_EL_D8L10]
C37  220uF/25V  [C_EL_D8L10]
C38  100nF/50V  [C0805]
C39  100nF  [C0603E]
C40  100nF  [C0603E]
C41  10uF  [C0603E]
C42  10uF  [C0603E]
C43  22uF  [C1206E]
C44  100nF  [C0603E]
C45  22uF/16V  [C1206E]
C46  22uF/16V  [C1206E]
C47  220uF/25V  [C_EL_D8L10]
C48  75pF  [C0603E]
C49  100nF  [C0603E]
C50  22uF  [C1206E]
C51  100nF  [C0603E]
C52  47uF/25V TAN D  [C_TN_7343]
C53  75pF  [C0603E]
C54  47uF/25V TAN D  [C_TN_7343]
C60  1uF  [C0603E]
C61  1uF  [C0603E]
C63  100nF  [C0603]
D2  SS56B  [SMB_L4.6-W3.6-LS5.3-RD]
D3  SMAJ15A  [DIOM5026X229N]
D4  NUP2105LT1G  [SOT95P237X111-3N]
D5  NUP2105LT1G  [SOT95P237X111-3N]
D6  SS56B  [SMB_L4.6-W3.6-LS5.3-RD]
F1  JFC1206 1300FS 63V 3A  [1206 FUSE]
L2  SLF12565T-330M2R8-PF  [IND-SMD_L12.3-W12.3]
L3  SPM6530T-2R2M  [IND_SPM6530T-2R2M-HZ]
L4  SLF12565T-330M2R8-PF  [IND-SMD_L12.3-W12.3]
L5  DFE252012F-100M=P2  [INDC2520X120N]
L6  TMPC0603H-100MG-D  [IND-SMD_L7.3-W6.6]
P3  KF2EDGV+K-3.81-2P  [PHOENIX_1803426]  (value not drawn)
P5  XH-8  [HDR1X8]
P6  KF2EDGV+K-3.81-2P  [PHOENIX_1803426]  (value not drawn)
R6  73.2K  [R0603E]
R7  100K/1%  [R0603E]
R13  10K  [R0603E]
R14  10K/1%  [R0603E]
R15  3.3K/1%  [R0603E]
R17  24K/1%  [R0603E]
R18  120  [R0603E]
R19  2.74K/1%  [R0603E]
R20  10K  [R0603E]
R22  120  [R0603E]
R23  100K/1%  [R0603E]
R24  10K  [R0603E]
R29  6.8K/1%  [R0603E]
R30  330/1%  [R0603E]
R38  100K  [R0603]
R39  10K  [R0603]
TP3  TEST POINT  [TEST_POINT]  (value not drawn)  (no BOM)
TP6  TEST POINT  [TEST_POINT]  (value not drawn)  (no BOM)
TP7  TEST POINT  [TEST_POINT]  (value not drawn)  (no BOM)
TP8  TEST POINT  [TEST_POINT]  (value not drawn)  (no BOM)
TP9  TEST POINT  [TEST_POINT]  (value not drawn)  (no BOM)
U4  SN65HVD230  [SO_8]
U5  SN65HVD230  [SO_8]
U6  XL6009  [TO-263-5]
U7  TLV76733DRVR  [SON65P200X200X80-7N]
U8  TPS54202DDC  [SOT95P280X100-6N]
U9  TPS54202DDC  [SOT95P280X100-6N]
U12  AP2120N-1.8TRG1  [SOT-23-3_L2.9-W1.3-P1.90-LS2.4-BR]
VDD_RADAR  TEST POINT  [TEST_POINT]  (value not drawn)  (no BOM)
VDD_RK3588  TEST POINT  [TEST_POINT]  (value not drawn)  (no BOM)

### Ports
RK_PWR_EN (in), ADC_Vin (out), CAN1_RXD (out), CAN1_TXD (in), CAN2_RXD (out), CAN2_TXD (in), RADAR_PWR_EN (in)

### Nets
1V8: +1.8V.1(TP) C60.2 U12.2(VOUT)
+5V: C42.2 C45.2 C46.2 C48.2 L5.2 R7.1 TP3.1(TP) U7.4(EN) U7.6(IN)
+12V_RK3588: C34.2 C36.1 L3.2 P6.1 VDD_RK3588.1(TP)
GND: C30.1 C31.1 C32.1 C35.2 C36.2 C37.2 C38.1 C39.1 C41.1 C42.1 C43.1 C44.1 C45.1 C46.1 C47.2 C50.1 C51.1 C52.2 C54.2 C60.1 C61.1 C63.1 D3.2(A) D4.3 D5.3 L4.2 P3.2 P5.8 P6.2 R13.2 R15.2 R19.2 R20.2 R24.2 R30.2 R39.1 U4.2(GND) U4.8(RS) U5.2(GND) U5.8(RS) U6.1(GND) U7.3(GND-1) U7.5(GND) U7.7(PAD) U8.1(GND) U9.1(GND) U12.1(GND)
VDD_MCU: +3.3V.1(TP) C32.2 C39.2 C41.2 C61.2 U4.3(VCC) U5.3(VCC) U7.1(OUT) U7.2(SNS) U12.3(VIN)
VDD_RADAR: C52.1 C53.2 C54.1 L6.2 P5.5 R23.1 VDD_RADAR.1(TP)
Vin: F1.1 P3.1
Vin_Pr: C30.2 C31.2 C37.1 C38.2 C43.2 C44.2 C47.1 C50.2 C51.2 D2.1(K) D3.1(K) L2.1 R6.1 R38.1 U6.4(VIN) U8.3(VIN) U9.3(VIN)
ADC_Vin: C63.2 R38.2 R39.2 ; port ADC_Vin
CAN1_H: D4.2 P5.1 R18.2 TP6.1(TP) U4.7(CANH)
CAN1_L: D4.1 P5.2 R18.1 TP7.1(TP) U4.6(CANL)
CAN1_RXD: U4.4(RXD) ; port CAN1_RXD
CAN1_TXD: U4.1(TXD) ; port CAN1_TXD
CAN2_H: D5.2 P5.3 R22.2 TP8.1(TP) U5.7(CANH)
CAN2_L: D5.1 P5.4 R22.1 TP9.1(TP) U5.6(CANL)
CAN2_RXD: U5.4(RXD) ; port CAN2_RXD
CAN2_TXD: U5.1(TXD) ; port CAN2_TXD
RADAR_PWR_EN: R24.1 U9.5(EN) ; port RADAR_PWR_EN
RK_PWR_EN: R20.1 U6.2(EN) ; port RK_PWR_EN
NetC33_1: C33.1 L2.2 U6.3(SW) U6.6(SW)
NetC33_2: C33.2 D6.2(A) L4.1
NetC34_1: C34.1 C35.1 D6.1(K) L3.1 R17.1
NetC40_1: C40.1 U8.6(BOOST)
NetC40_2: C40.2 L5.1 U8.2(SW)
NetC48_1: C48.1 R7.2 R14.1 U8.4(FB)
NetC49_1: C49.1 U9.6(BOOST)
NetC49_2: C49.2 L6.1 U9.2(SW)
NetC53_1: C53.1 R23.2 R29.1 U9.4(FB)
NetD2_2: D2.2(A) F1.2
NetR6_2: R6.2 R13.1 U8.5(EN)
NetR14_2: R14.2 R15.1
NetR17_2: R17.2 R19.1 U6.5(FB)
NetR29_2: R29.2 R30.1

Not connected (* = marked no-connect by the designer): P5 6* 7*; U4 5(VREF)*; U5 5(VREF)*

### Notes on the sheet
- RK3588
- (near P5) RADAR
- (100K/13.3K)+1 * 0.596 = 5V
- RADAR
- (100K/7.15K)+1 * 0.596 = 9V
- (near +3.3V) STM32

### Library data of the parts
+1.8V +3.3V TP3 TP6-TP9 VDD_RADAR VDD_RK3588 = TEST POINT: Board Qty: 100; PCB Name: Main_PCB
C30 C43 C45 C46 C50 = CAP_SMD_MLCC_22u25V: CAP, MLCC, X5R 22uF 25V 20% 1206; PARAM: X5R, 20%; MANF_P#: TMK316BBJ226ML-T; MANF: Taiyo Yuden; DESC: CAP, MLCC, 22uF, 25V, X5R,  20%, 1206; PARAM2: 25V; PRICE: 0.572$
  C30 C43 C50: VALUE: 22uF
  C45 C46: VALUE: 22uF/16V
C31 C32 C39-C42 C44 C48 C49 C51 C53 C60 C61 = Capacitor SMD
  C31: Value: 10nF/50V
  C32 C39 C40 C44 C49 C51: Value: 100nF
  C41 C42: Value: 10uF
  C48 C53: Value: 75pF
  C60 C61: Value: 1uF
C33 C34 = 47uF: Manufacturer Part: GRM32ER71A476ME15L; catid: 20; spicePre: C
C35 C36 = CAP_SMD_EL_220uF_35v: CAP, SMD, ELEC,; MANF_P#: MANF_PART#; DESC: DESCRIPTION; DIST#: MOUSER; PARAM: 20%; PARAM2: 35v; VALUE: 220uF; PRICE: 10= -$; MANF: MANF; ASSEMBLY: ASSEMBLY
C37 C47 = CAP_SMD_EL_220uF_35v: CAP, SMD, ELEC,; PN: VZH221M1ETR-0810; MANF_P#: MANF_PART#; DESC: DESCRIPTION; DIST#: MOUSER; PARAM: 20%; PARAM2: 35v; VALUE: 220uF; MANF: MANF; ASSEMBLY: ASSEMBLY; Parameter 1: *
C38 = 224: Manufacturer: FH; Manufacturer Part: 0805F224M500NT; nameAlias: Capacitance; Supplier: LCSC; Supplier Part: C41051; JLCPCB Part Class: Extended Part; spicePre: C; spiceSymbolName: 0805F224M500NT_C41051
C52 C54 = CAP_SMD_TAN: CAP, SMD, TAN; PARAM: 20%, 300mOhm, -55~105oC; MANF: VISHAY; MANF_P#: T55A106M6R3C0300; PARAM2: 6.3V; VALUE: -uF; PRICE: 0.46$
C63 = CAP: Value: 100pF; Published: 8-Jun-2000; Revision: July-2002: Re-released for DXP Platform.; Publisher: Altium Limited
D2 D6 = SS54C: 40V 5A Schottky Rectifier; Manufacturer: LGE(鲁光); Manufacturer Part: SS54; Contributor: LCSC; Supplier: LCSC; Supplier Part: C330398; JLCPCB Part Class: Extended Part; spicePre: D; spiceSymbolName: SS54C
D3 = SMAJ24A: TVS Diode (Uni-directional); Manufacturer_Name: LITTELFUSE; Datasheet Link: https://componentsearchengine.com/Datasheets/2/SMAJ24A.pdf; Height: 2.29mm; Manufacturer_Part_Number: SMAJ24A; Mouser Part Number: 576-SMAJ24A; Mouser Price/Stock: https://www.mouser.co.uk/ProductDetail/Littelfuse/SMAJ24A?qs=HR2RnyOI4E78ZevQKM2hdA%3D%3D; Arrow Part Number: SMAJ24A; Arrow Price/Stock: https://www.arrow.com/en/products/smaj24a/littelfuse?region=nac
D4 D5 = NUP2105LT1G: Dual Bi-Directional TVS Diode 350W 3-Pin SOT-23 | ON Semiconductor NUP2105LT1G; SnapEDA_Link: https://www.snapeda.com/parts/NUP2105LT1G/Onsemi/view-part/?ref=snap; Package: SOT-23-3 ON Semiconductor; Value: *; MF: ON Semiconductor; MP: NUP2105LT1G; Check_prices: https://www.snapeda.com/parts/NUP2105LT1G/Onsemi/view-part/?ref=eda
F1 = Fuse SMD1206: Fuse Type Fast Acting with 63V, 3A, 1206; Designer: Abbas Basereh; Desc.: SMD Fuses 1206; Data: 16-12-2016
L2 L4 = 33uH: Manufacturer: SHOU HAN(首韩); Manufacturer Part: CYH125-33UH; nameAlias: Inductance; Contributor: lcsc; Supplier: LCSC; Supplier Part: C2879698; JLCPCB Part Class: Extended Part; spicePre: L; spiceSymbolName: CYH125-33UH
L3 = SPM6530T-2R2M-HZ: MF: {'manufacturer': u'TDK Corporation'}; Package: None; MP: SPM6530T-2R2M-HZ; Value: *; Availability: Unavailable; Price: None
L5 = DFE252012F-100M=P2: Inductor with Inductance: 10uH Tol. +/-20%, Package: 1008 (2520); MF: Murata Electronics; SnapEDA_Link: https://www.snapeda.com/parts/DFE252012F-100M=P2/Murata%20Electronics%20North%20America/view-part/1498782/?ref=snap; Value: *; Digi-Key_Part_Number: 490-13050-1-ND; Mouser-Purchase-URL: https://snapeda.com/shop?store=Mouser&id=1498782; MP: DFE252012F-100M=P2; DigiKey-Purchase-URL: https://snapeda.com/shop?store=DigiKey&id=1498782; Package: 2520 Murata; Check_prices: https://www.snapeda.com/parts/DFE252012F-100M=P2/Murata%20Electronics%20North%20America/view-part/1498782/?ref=eda
L6 = IND1008_1UH_20%_WURTH_74479787210B: Inductor; Part Description: Power Multilayer Inductor (WE-PMI Series); Manufacturer: WURTH ELEKTRONIK; Power: 1.95A; Resistance: 0.06R; Tolerance: ±20%; Part Number: IND1008_1UH_20%_WURTH_74479787210B; Component Kind: Standard; Component Type: Standard; Footprint: INDC2620X100N; Pin Count: 2; Value: TMPC0603H-100MG-D; Manufacturer Part Number: 74479787210B; Case: 1008; Mounted: Yes; Socket: No; SMD: Yes; Sense: No; ComponentHeight: 1mm; HelpURL: \\cern.ch\dfs\Applications\Altium\Datasheets\IND_WURTH_WE-PMI_74479787210B.pdf; Author: CERN DEM JLC; CreateDate: 10/1/2014; LatestRevisionDate: 10/1/2014
P3 P6 = PHOENIX_1803426: Connector 2 Male; Part Description: 8A 160 V, Pitch: 3.81mm, 2 Positions Header; Manufacturer: PHOENIX CONTACT; Manufacturer Part Number: 1803426 (MCV 1,5/2-G-3,81); PressFit: No; Part Number: PHOENIX_1803426; Component Kind: Standard; Component Type: Standard; Pin Count: 2; Mounted: Yes; Socket: No; SMD: No; Sense: No; Status: None; ComponentHeight: 9.2mm; HelpURL: \\cern.ch\dfs\Applications\Altium\Datasheets\PHOENIX_1803426.pdf; Author: CERN DEM JLC; CreateDate: 5/4/2010; LatestRevisionDate: 5/4/2010
P5 = Header 8: Header, 8-Pin; LatestRevisionDate: 17-Jul-2002; LatestRevisionNote: Re-released for DXP Platform.; Publisher: Altium Limited
R6 R7 R13-R15 R18 R20 R22-R24 R29 R30 R38 R39 = Resistor SMD
  R6: Value: 73.2K
  R7 R23: Value: 100K/1%
  R13 R20 R24 R39: Value: 10K
  R14: Value: 10K/1%
  R15: Value: 3.3K/1%
  R18 R22: Value: 120
  R29: Value: 6.8K/1%
  R30: Value: 330/1%
  R38: Value: 100K
R17 R19 = Resistor SMD: Value: 100K
U4 U5 = SN65HVD230_SOP8: CAN,  Transceivers, 3.3V (VDD); MANF: Texas Instruments; MANF_P#: SN65HVD230D, SN65HVD230QD; PARAM: -40~85oC; PRICE: 2.3$@MOUSER; PARAM2: 3.3V (VDD); VALUE: SN65HVD230
U6 = XL6009: Manufacturer: XLSEMI; sourceId: BD9FzR93l; Contributor: GerryChen; Supplier: LCSC; Manufacturer Part: XL6009; spicePre: U; Supplier Part: C15831
U7 = TLV76733DRVR: Adjustable- and fixed-output, 1-A, 16-V, positive-voltage low-dropout (LDO) linear regulator; MF: Texas Instruments; SnapEDA_Link: https://www.snapeda.com/parts/TLV76733DRVR/Texas+Instruments/view-part/?ref=snap; Package: WSON-6 Texas Instruments; Value: *; MP: TLV76733DRVR; Check_prices: https://www.snapeda.com/parts/TLV76733DRVR/Texas+Instruments/view-part/?ref=eda
U8 U9 = TPS54202DDC: 4.5V to 28V Input, 2-A Output, EMI Friendly / Synchronous Step Down Converter; Part Description: 4.5V to 28V Input, 2A Output, EMI Friendly Synchronous Step Down Converter; Manufacturer: TEXAS INSTRUMENTS; PressFit: No; Bonding: No; Part Number: TPS54202DDC; Component Kind: Standard; Component Type: Standard; Device: TPS54202DDC; PackageDescription: SOT23, 0.95mm Pitch; 6 Pin, 1.625mm W X 2.90mm L X 1.00mm H body, IPC Medium Density; Manufacturer Part Number: TPS54202DDC; Pin Count: 5; Case: SOT23-6; Mounted: Yes; Socket: No; SMD: Yes; Sense: No; ComponentHeight: 1.1mm; HelpURL: \\cern.ch\dfs\Applications\Altium\Datasheets\TPS54202.pdf; Author: CERN DEM HF; CreateDate: 6/10/2022; LatestRevisionDate: 6/10/2022
U12 = AP2120N-3.3TRG1: Manufacturer: DIODES(美台); Add into BOM: yes; Maximum Input Voltage: 6V; Output Voltage: 3.3V; MAX Output Current: 150mA; Power Supply Rejection Ratio (PSRR): 65dB@(1kHz); Dropout Voltage: 500mV@(150mA); standby current: 50uA; Output Polarity: Positive electrode; Number of Outputs: 1; Symbol: AP2120N-3.3TRG1; Device: AP2120N-3.3TRG1; LCSC Part Name: 输入6V 输出3.3V 150mA; Supplier Part: C156330; Manufacturer Part: AP2120N-3.3TRG1; Supplier Footprint: SOT-23; JLCPCB Part Class: Extended Part; Datasheet: https://atta.szlcsc.com/upload/public/pdf/source/20180307/C156330_15204110207831407988.pdf; Supplier: LCSC; Convert to PCB: yes; Operating Temperature: -40℃~+85℃

## Nets that join several sheets
1V8: STM32H743IIT6 (C58.1 U10.2), Power_CAN_IO_GPS (+1.8V.1 C60.2 U12.2)
+5V: USB_OTG_FS (U3.5), Power_CAN_IO_GPS (9 pins)
GND: STM32H743IIT6 (81 pins), Ethernet (24 pins), USB_OTG_FS (7 pins), Power_CAN_IO_GPS (47 pins)
VBUS_FS1: STM32H743IIT6 (R8.1), USB_OTG_FS (C29.1 CN1.1 D1.6 U3.1)
VDD_MCU: STM32H743IIT6 (57 pins), Ethernet (8 pins), USB_OTG_FS (R12.1), Power_CAN_IO_GPS (10 pins)
ADC_Vin: STM32H743IIT6 (U1.20), Power_CAN_IO_GPS (C63.2 R38.2 R39.2)
CAN1_RXD: STM32H743IIT6 (U1.129), Power_CAN_IO_GPS (U4.4)
CAN1_TXD: STM32H743IIT6 (U1.128), Power_CAN_IO_GPS (U4.1)
CAN2_RXD: STM32H743IIT6 (U1.92), Power_CAN_IO_GPS (U5.4)
CAN2_TXD: STM32H743IIT6 (U1.93), Power_CAN_IO_GPS (U5.1)
ETH_MDC: STM32H743IIT6 (U1.33), Ethernet (U15.13)
ETH_MDIO: STM32H743IIT6 (U1.42), Ethernet (R57.2)
RADAR_PWR_EN: STM32H743IIT6 (U1.106), Power_CAN_IO_GPS (R24.1 U9.5)
RK_PWR_EN: STM32H743IIT6 (U1.70), Power_CAN_IO_GPS (R20.1 U6.2)
RMII_CRS_DV: STM32H743IIT6 (U1.53), Ethernet (R55.2)
RMII_nRESET: STM32H743IIT6 (U1.32), Ethernet (U15.15)
RMII_REF_CLK: STM32H743IIT6 (U1.41), Ethernet (R60.2)
RMII_RXD0: STM32H743IIT6 (U1.54), Ethernet (R51.2)
RMII_RXD1: STM32H743IIT6 (U1.55), Ethernet (R52.2)
RMII_TX_EN: STM32H743IIT6 (U1.154), Ethernet (U15.16)
RMII_TXD0: STM32H743IIT6 (U1.156), Ethernet (U15.17)
RMII_TXD1: STM32H743IIT6 (U1.155), Ethernet (U15.18)
USB_FS1_D_N: STM32H743IIT6 (U1.122), USB_OTG_FS (CN1.2 D1.4)
USB_FS1_D_P: STM32H743IIT6 (U1.123), USB_OTG_FS (CN1.3 D1.3)
USB_FS1_ID: STM32H743IIT6 (U1.121), USB_OTG_FS (CN1.4 D1.1)
USB_PwrSwitchON: STM32H743IIT6 (U1.119), USB_OTG_FS (R5.1 U3.4)